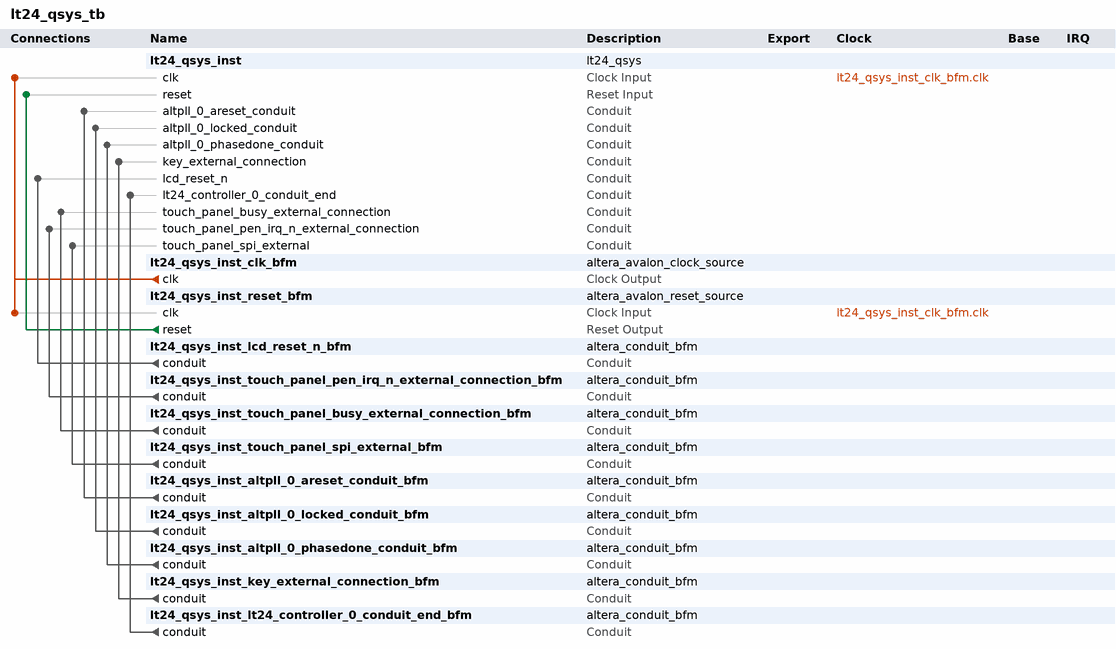
[diagram p0: system contents]
# Platform Designer (Qsys) system lt24_qsys_tb, Cyclone V 5CGXFC5C6F27C7
# Parameters at their usual value, and those the tool derives, are not listed.
package require -exact qsys 13.1
create_system lt24_qsys_tb
set_project_property DEVICE_FAMILY {Cyclone V}
set_project_property DEVICE 5CGXFC5C6F27C7

add_instance lt24_qsys_inst lt24_qsys 1.0

add_instance lt24_qsys_inst_clk_bfm altera_avalon_clock_source 13.1

add_instance lt24_qsys_inst_reset_bfm altera_avalon_reset_source 13.1
set_instance_parameter_value lt24_qsys_inst_reset_bfm ASSERT_HIGH_RESET 0
set_instance_parameter_value lt24_qsys_inst_reset_bfm INITIAL_RESET_CYCLES 50

add_instance lt24_qsys_inst_lcd_reset_n_bfm altera_conduit_bfm 13.1
set_instance_parameter_value lt24_qsys_inst_lcd_reset_n_bfm CLOCKED_SIGNAL false
set_instance_parameter_value lt24_qsys_inst_lcd_reset_n_bfm ENABLE_RESET false
set_instance_parameter_value lt24_qsys_inst_lcd_reset_n_bfm SIGNAL_WIDTHS 1
set_instance_parameter_value lt24_qsys_inst_lcd_reset_n_bfm SIGNAL_DIRECTIONS input

add_instance lt24_qsys_inst_touch_panel_pen_irq_n_external_connection_bfm altera_conduit_bfm 13.1
set_instance_parameter_value lt24_qsys_inst_touch_panel_pen_irq_n_external_connection_bfm CLOCKED_SIGNAL false
set_instance_parameter_value lt24_qsys_inst_touch_panel_pen_irq_n_external_connection_bfm ENABLE_RESET false
set_instance_parameter_value lt24_qsys_inst_touch_panel_pen_irq_n_external_connection_bfm SIGNAL_WIDTHS 1
set_instance_parameter_value lt24_qsys_inst_touch_panel_pen_irq_n_external_connection_bfm SIGNAL_DIRECTIONS output

add_instance lt24_qsys_inst_touch_panel_busy_external_connection_bfm altera_conduit_bfm 13.1
set_instance_parameter_value lt24_qsys_inst_touch_panel_busy_external_connection_bfm CLOCKED_SIGNAL false
set_instance_parameter_value lt24_qsys_inst_touch_panel_busy_external_connection_bfm ENABLE_RESET false
set_instance_parameter_value lt24_qsys_inst_touch_panel_busy_external_connection_bfm SIGNAL_WIDTHS 1
set_instance_parameter_value lt24_qsys_inst_touch_panel_busy_external_connection_bfm SIGNAL_DIRECTIONS output

add_instance lt24_qsys_inst_touch_panel_spi_external_bfm altera_conduit_bfm 13.1
set_instance_parameter_value lt24_qsys_inst_touch_panel_spi_external_bfm CLOCKED_SIGNAL false
set_instance_parameter_value lt24_qsys_inst_touch_panel_spi_external_bfm ENABLE_RESET false
set_instance_parameter_value lt24_qsys_inst_touch_panel_spi_external_bfm SIGNAL_ROLES MISO,MOSI,SCLK,SS_n
set_instance_parameter_value lt24_qsys_inst_touch_panel_spi_external_bfm SIGNAL_WIDTHS 1,1,1,1
set_instance_parameter_value lt24_qsys_inst_touch_panel_spi_external_bfm SIGNAL_DIRECTIONS output,input,input,input

add_instance lt24_qsys_inst_altpll_0_areset_conduit_bfm altera_conduit_bfm 13.1
set_instance_parameter_value lt24_qsys_inst_altpll_0_areset_conduit_bfm CLOCKED_SIGNAL false
set_instance_parameter_value lt24_qsys_inst_altpll_0_areset_conduit_bfm ENABLE_RESET false
set_instance_parameter_value lt24_qsys_inst_altpll_0_areset_conduit_bfm SIGNAL_WIDTHS 1
set_instance_parameter_value lt24_qsys_inst_altpll_0_areset_conduit_bfm SIGNAL_DIRECTIONS output

add_instance lt24_qsys_inst_altpll_0_locked_conduit_bfm altera_conduit_bfm 13.1
set_instance_parameter_value lt24_qsys_inst_altpll_0_locked_conduit_bfm CLOCKED_SIGNAL false
set_instance_parameter_value lt24_qsys_inst_altpll_0_locked_conduit_bfm ENABLE_RESET false
set_instance_parameter_value lt24_qsys_inst_altpll_0_locked_conduit_bfm SIGNAL_WIDTHS 1
set_instance_parameter_value lt24_qsys_inst_altpll_0_locked_conduit_bfm SIGNAL_DIRECTIONS input

add_instance lt24_qsys_inst_altpll_0_phasedone_conduit_bfm altera_conduit_bfm 13.1
set_instance_parameter_value lt24_qsys_inst_altpll_0_phasedone_conduit_bfm CLOCKED_SIGNAL false
set_instance_parameter_value lt24_qsys_inst_altpll_0_phasedone_conduit_bfm ENABLE_RESET false
set_instance_parameter_value lt24_qsys_inst_altpll_0_phasedone_conduit_bfm SIGNAL_WIDTHS 1
set_instance_parameter_value lt24_qsys_inst_altpll_0_phasedone_conduit_bfm SIGNAL_DIRECTIONS input

add_instance lt24_qsys_inst_key_external_connection_bfm altera_conduit_bfm 13.1
set_instance_parameter_value lt24_qsys_inst_key_external_connection_bfm CLOCKED_SIGNAL false
set_instance_parameter_value lt24_qsys_inst_key_external_connection_bfm ENABLE_RESET false
set_instance_parameter_value lt24_qsys_inst_key_external_connection_bfm SIGNAL_WIDTHS 4
set_instance_parameter_value lt24_qsys_inst_key_external_connection_bfm SIGNAL_DIRECTIONS output

add_instance lt24_qsys_inst_lt24_controller_0_conduit_end_bfm altera_conduit_bfm 13.1
set_instance_parameter_value lt24_qsys_inst_lt24_controller_0_conduit_end_bfm CLOCKED_SIGNAL false
set_instance_parameter_value lt24_qsys_inst_lt24_controller_0_conduit_end_bfm ENABLE_RESET false
set_instance_parameter_value lt24_qsys_inst_lt24_controller_0_conduit_end_bfm SIGNAL_ROLES cs,rs,rd,wr,data
set_instance_parameter_value lt24_qsys_inst_lt24_controller_0_conduit_end_bfm SIGNAL_WIDTHS 1,1,1,1,16
set_instance_parameter_value lt24_qsys_inst_lt24_controller_0_conduit_end_bfm SIGNAL_DIRECTIONS input,input,input,input,input

# connections
add_connection lt24_qsys_inst_clk_bfm.clk lt24_qsys_inst.clk clock
add_connection lt24_qsys_inst_clk_bfm.clk lt24_qsys_inst_reset_bfm.clk clock
add_connection lt24_qsys_inst_reset_bfm.reset lt24_qsys_inst.reset reset
add_connection lt24_qsys_inst_altpll_0_areset_conduit_bfm.conduit lt24_qsys_inst.altpll_0_areset_conduit conduit
add_connection lt24_qsys_inst_altpll_0_locked_conduit_bfm.conduit lt24_qsys_inst.altpll_0_locked_conduit conduit
add_connection lt24_qsys_inst_altpll_0_phasedone_conduit_bfm.conduit lt24_qsys_inst.altpll_0_phasedone_conduit conduit
add_connection lt24_qsys_inst_key_external_connection_bfm.conduit lt24_qsys_inst.key_external_connection conduit
add_connection lt24_qsys_inst_lcd_reset_n_bfm.conduit lt24_qsys_inst.lcd_reset_n conduit
add_connection lt24_qsys_inst_lt24_controller_0_conduit_end_bfm.conduit lt24_qsys_inst.lt24_controller_0_conduit_end conduit
add_connection lt24_qsys_inst_touch_panel_busy_external_connection_bfm.conduit lt24_qsys_inst.touch_panel_busy_external_connection conduit
add_connection lt24_qsys_inst_touch_panel_pen_irq_n_external_connection_bfm.conduit lt24_qsys_inst.touch_panel_pen_irq_n_external_connection conduit
add_connection lt24_qsys_inst_touch_panel_spi_external_bfm.conduit lt24_qsys_inst.touch_panel_spi_external conduit

set_interconnect_requirement {$system} qsys_mm.clockCrossingAdapter HANDSHAKE
set_interconnect_requirement {$system} qsys_mm.maxAdditionalLatency 1
set_interconnect_requirement {$system} qsys_mm.insertDefaultSlave false

save_system lt24_qsys_tb.qsys
